# EAGLE design lab5 (EAGLE 7.2.0)
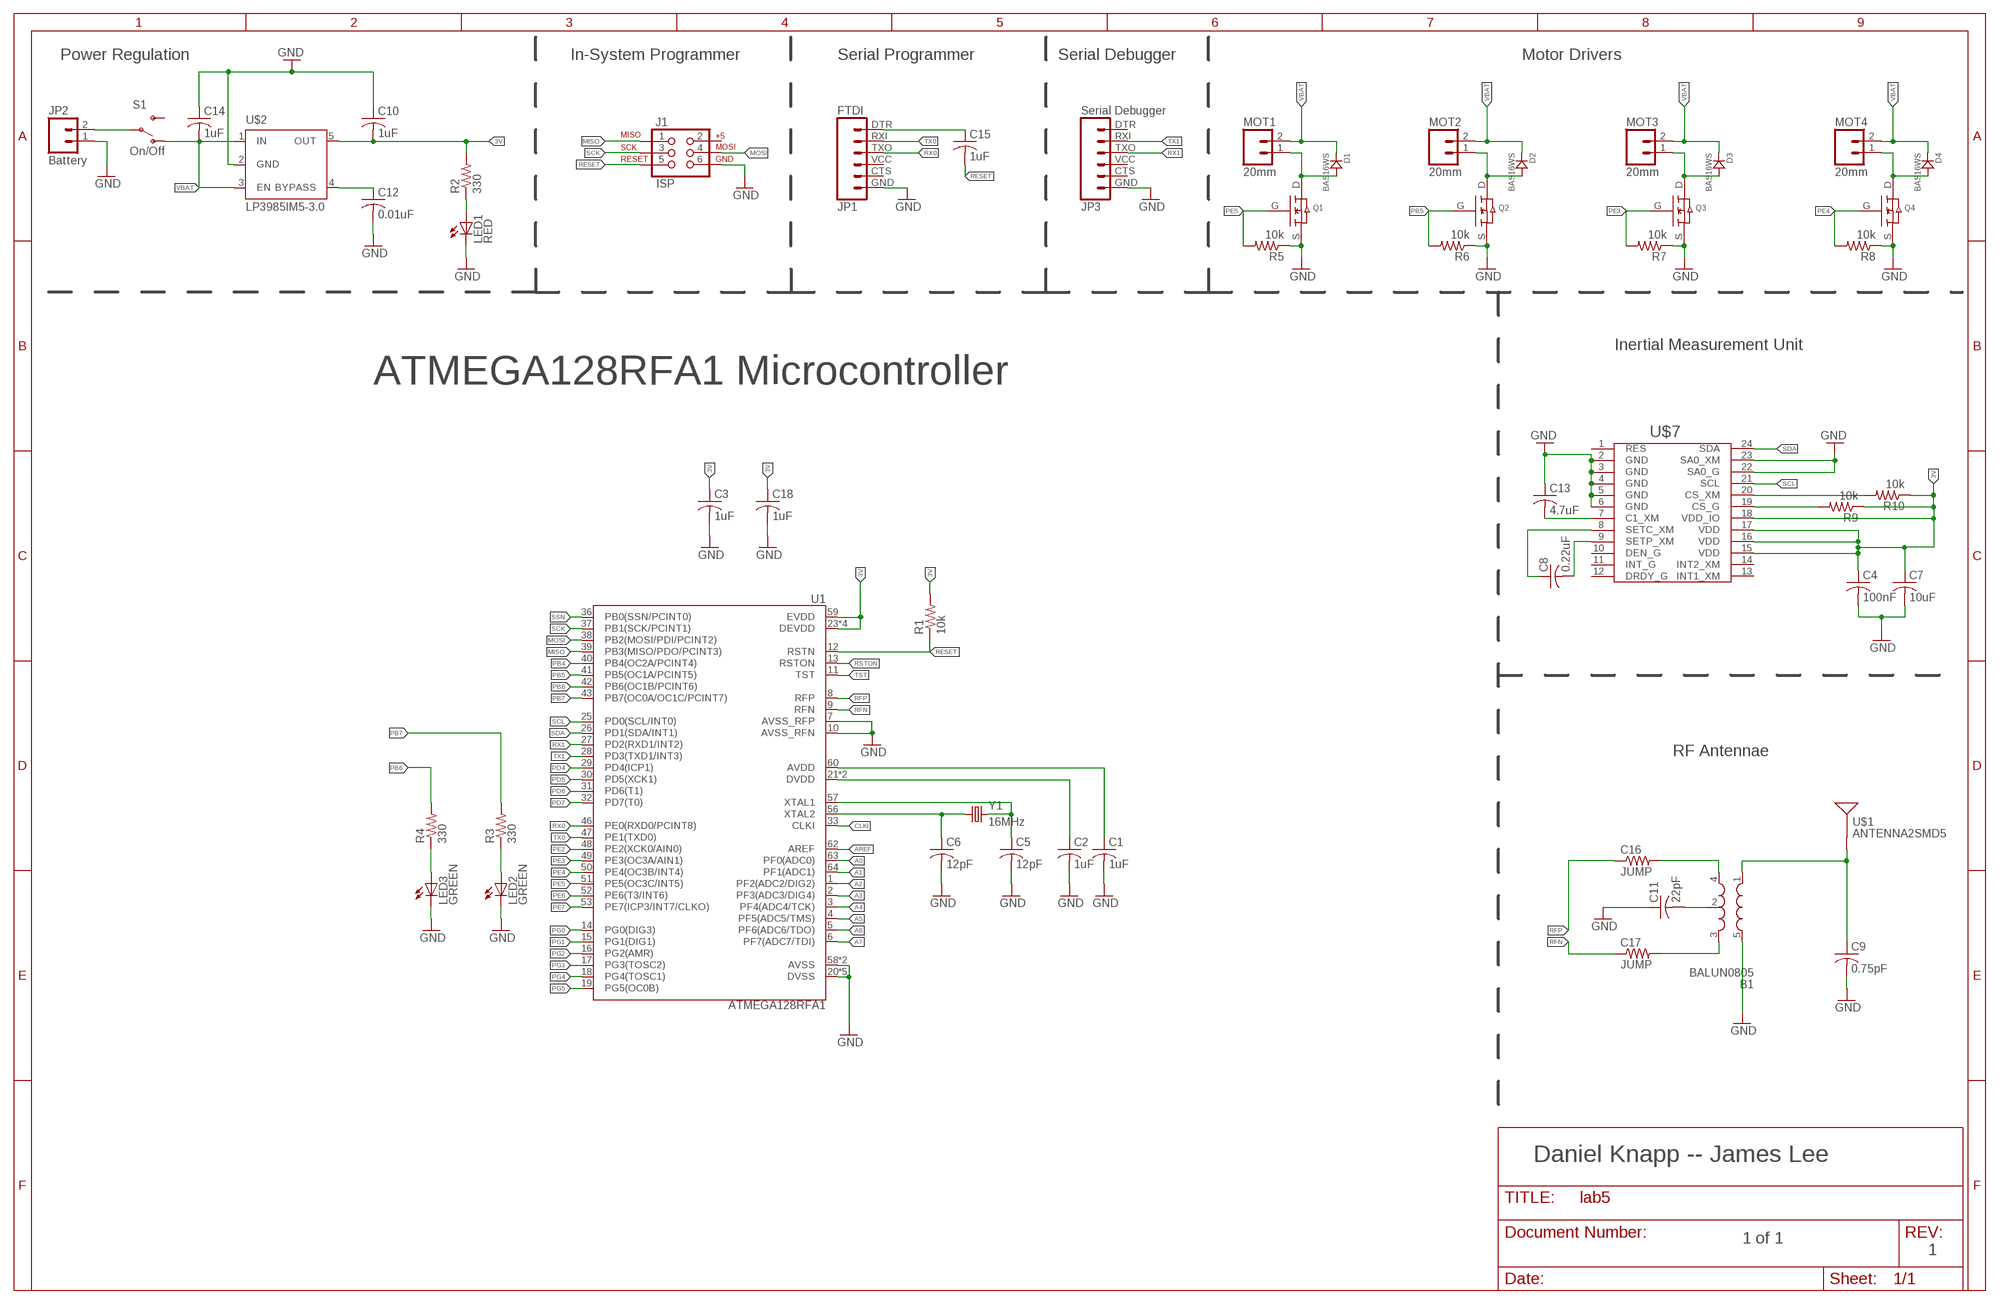
[diagram p0: schematic, sheet 1]

## Parts
B1  BALUN0805  [BALUN]
C1  1uF  C-USC0805  [C0805]
C2  1uF  C-USC0805  [C0805]
C3  1uF  C-USC0805  [C0805]
C4  100nF  C-USC0805  [C0805]
C5  12pF  C-USC0805  [C0805]
C6  12pF  C-USC0805  [C0805]
C7  10uF  C-USC0805  [C0805]
C8  0.22uF  C-USC0805  [C0805]
C9  0.75pF  C-USC0805  [C0805]
C10  1uF  C-USC0805  [C0805]
C11  22pF  C-USC0805  [C0805]
C12  0.01uF  C-USC0805  [C0805]
C13  4.7uF  C-USC0805  [C0805]
C14  1uF  C-USC0805  [C0805]
C15  1uF  C-USC0805  [C0805]
C16  JUMP  R-US_R0805  [R0805]
C17  JUMP  R-US_R0805  [R0805]
C18  1uF  C-USC0805  [C0805]
D1  BAS16WS  [BAS16WS]
D2  BAS16WS  [BAS16WS]
D3  BAS16WS  [BAS16WS]
D4  BAS16WS  [BAS16WS]
J1  ISP  AVR_SPI_PRG_6NS  [2X3-NS]
JP1  FTDI  FTDI_BASICPTH  [FTDI_BASIC]
JP2  Battery  M02PTH  [1X02]
JP3  Serial Debugger  FTDI_BASICPTH  [FTDI_BASIC]
LED1  RED  LEDCHIP-LED0805  [CHIP-LED0805]
LED2  GREEN  LEDCHIP-LED0805  [CHIP-LED0805]
LED3  GREEN  LEDCHIP-LED0805  [CHIP-LED0805]
MOT1  20mm  M02PTH  [1X02]
MOT2  20mm  M02PTH  [1X02]
MOT3  20mm  M02PTH  [1X02]
MOT4  20mm  M02PTH  [1X02]
Q1  SI2302CDS  [SI2302CDS]
Q2  SI2302CDS  [SI2302CDS]
Q3  SI2302CDS  [SI2302CDS]
Q4  SI2302CDS  [SI2302CDS]
R1  10k  R-US_R0805  [R0805]
R2  330  R-US_R0805  [R0805]
R3  330  R-US_R0805  [R0805]
R4  330  R-US_R0805  [R0805]
R5  10k  R-US_R0805  [R0805]
R6  10k  R-US_R0805  [R0805]
R7  10k  R-US_R0805  [R0805]
R8  10k  R-US_R0805  [R0805]
R9  10k  R-US_R0805  [R0805]
R10  10k  R-US_R0805  [R0805]
S1  On/Off  SWITCH-SPDTPTH  [SWITCH-SPDT]
U1  ATMEGA128RFA1  [QFN-64]
U$1  ANTENNA2SMD5  [ANTENNA-CHIP5]
U$2  LP3985IM5-3.0  [SOT23-DBV]
U$7  LSM9DS0  [LSM9DS0]
Y1  16MHz  CRYSTAL5X3  [CRYSTAL-SMD-5X3]

## Nets
3V: C3.1 C4.1 C7.1 C10.2 C18.1 R1.2 R2.2 R9.1 R10.1 U1.23(DEVDD) U1.34(DEVDD) U1.44(DEVDD) U1.54(DEVDD) U1.59(EVDD) U$2.5(OUT) U$7.15(VDD) U$7.16(VDD) U$7.17(VDD) U$7.18(VDD_IO)
A0: U1.63(PF0(ADC0))
A1: U1.64(PF1(ADC1))
A2: U1.1(PF2(ADC2/DIG2))
A3: U1.2(PF3(ADC3/DIG4))
A4: U1.3(PF4(ADC4/TCK))
A5: U1.4(PF5(ADC5/TMS))
A6: U1.5(PF6(ADC6/TDO))
A7: U1.6(PF7(ADC7/TDI))
AREF: U1.62(AREF)
CLKI: U1.33(CLKI)
GND: B1.5(GND) C1.2 C2.2 C3.2 C4.2 C5.2 C6.2 C7.2 C9.2 C10.1 C11.1 C12.2 C13.1 C14.1 C18.2 J1.6 JP1.GND JP2.1 JP3.GND LED1.C LED2.C LED3.C Q1.S Q2.S Q3.S Q4.S R5.1 R6.1 R7.1 R8.1 U1.7(AVSS_RFP) U1.10(AVSS_RFN) U1.20(DVSS) U1.24(DVSS) U1.35(DVSS) U1.45(DVSS) U1.55(DVSS) U1.58(AVSS) U1.61(AVSS) U$2.2(GND) U$7.2(GND) U$7.3(GND) U$7.4(GND) U$7.5(GND) U$7.6(GND) U$7.22(SA0_G) U$7.23(SA0_XM)
MISO: J1.1 U1.39(PB3(MISO/PDO/PCINT3))
MOSI: J1.4 U1.38(PB2(MOSI/PDI/PCINT2))
N$2: C12.1 U$2.4(BYPASS)
N$3: C15.1 JP1.DTR
N$4: LED1.A R2.1
N$5: C5.1 U1.57(XTAL1) Y1.3
N$6: JP2.2 S1.2(P)
N$7: C6.1 U1.56(XTAL2) Y1.1
N$8: C2.1 U1.21(DVDD) U1.22(DVDD)
N$9: C1.1 U1.60(AVDD)
N$10: B1.3(OUT2) C17.2
N$11: B1.2(GND) C11.2
N$12: B1.4(OUT1) C16.2
N$15: B1.1(IN) C9.1 U$1.FEED(SIGNAL)
N$16: LED3.A R4.1
N$17: LED2.A R3.1
N$18: D1.P$2 MOT1.1 Q1.D
N$20: D2.P$2 MOT2.1 Q2.D
N$22: D3.P$2 MOT3.1 Q3.D
N$24: D4.P$2 MOT4.1 Q4.D
N$25: C8.1 U$7.8(SETC_XM)
N$26: C8.2 U$7.9(SETP_XM)
N$27: C13.2 U$7.7(C1_XM)
N$29: R9.2 U$7.19(CS_G)
N$30: R10.2 U$7.20(CS_XM)
PB4: U1.40(PB4(OC2A/PCINT4))
PB5: Q2.G R6.2 U1.41(PB5(OC1A/PCINT5))
PB6: R4.2 U1.42(PB6(OC1B/PCINT6))
PB7: R3.2 U1.43(PB7(OC0A/OC1C/PCINT7))
PD4: U1.29(PD4(ICP1))
PD5: U1.30(PD5(XCK1))
PD6: U1.31(PD6(T1))
PD7: U1.32(PD7(T0))
PE2: U1.48(PE2(XCK0/AIN0))
PE3: Q3.G R7.2 U1.49(PE3(OC3A/AIN1))
PE4: Q4.G R8.2 U1.50(PE4(OC3B/INT4))
PE5: Q1.G R5.2 U1.51(PE5(OC3C/INT5))
PE6: U1.52(PE6(T3/INT6))
PE7: U1.53(PE7(ICP3/INT7/CLKO))
PG0: U1.14(PG0(DIG3))
PG1: U1.15(PG1(DIG1))
PG2: U1.16(PG2(AMR))
PG3: U1.17(PG3(TOSC2))
PG4: U1.18(PG4(TOSC1))
PG5: U1.19(PG5(OC0B))
RESET: C15.2 J1.5 R1.1 U1.12(RSTN)
RFN: C17.1 U1.9(RFN)
RFP: C16.1 U1.8(RFP)
RSTON: U1.13(RSTON)
RX0: JP1.TXO U1.46(PE0(RXD0/PCINT8))
RX1: JP3.TXO U1.27(PD2(RXD1/INT2))
SCK: J1.3 U1.37(PB1(SCK/PCINT1))
SCL: U1.25(PD0(SCL/INT0)) U$7.21(SCL)
SDA: U1.26(PD1(SDA/INT1)) U$7.24(SDA)
SSN: U1.36(PB0(SSN/PCINT0))
TST: U1.11(TST)
TX0: JP1.RXI U1.47(PE1(TXD0))
TX1: JP3.RXI U1.28(PD3(TXD1/INT3))
VBAT: C14.2 D1.P$1 D2.P$1 D3.P$1 D4.P$1 MOT1.2 MOT2.2 MOT3.2 MOT4.2 S1.1(O) U$2.1(IN) U$2.3(EN)
Unconnected: J1.2 JP1.CTS JP1.VCC JP3.CTS JP3.DTR JP3.VCC S1.3(S) U$7.1(RES) U$7.10(DEN_G) U$7.11(INT_G) U$7.12(DRDY_G) U$7.13(INT1_XM) U$7.14(INT2_XM)

## Notes on the sheet
- Power Regulation | In-System Programmer | Serial Programmer | Serial Debugger | Motor Drivers
- Inertial Measurement Unit
- ATMEGA128RFA1 Microcontroller
- RF Antennae
- Daniel Knapp -- James Lee
- 1 of 1
- 1

## Library data of the parts
B1 = lab5_comps:BALUN: 0805 footprint balun- Ember 351/357
C1-C15 C18 = lab5_comps:C-US: CAPACITOR, American symbol
C16 C17 R1-R10 = lab5_comps:R-US_: RESISTOR, American symbol
D1-D4 = lab5_comps:BAS16WS; CREATOR: Daniel Knapp; DIST: Digikey
J1 = lab5_comps:AVR_SPI_PRG_6: AVR ISP 6 Pin This is the reduced ISP connector for AVR programming. Common on Arduino. This footprint will take up less PCB space and can be used with a 10-pin to 6-pin adapter such as SKU: BOB-08508
JP1 JP3 = lab5_comps:FTDI_BASIC: FTDI Basic header with labels
JP2 MOT1-MOT4 = lab5_comps:M02: Header 2 Standard 2-pin 0.1" header. Use with straight break away headers (SKU : PRT-00116), right angle break away headers (PRT-00553), swiss pins (PRT-00743), machine pins (PRT-00117), and female headers (PRT-00115). Molex polarized connector foot print use with SKU : PRT-08233 with associated crimp pins and housings.
LED1-LED3 = lab5_comps:LED: LED OSRAM: - CHIPLED LG R971, LG N971, LY N971, LG Q971, LY Q971, LO R971, LY R971 LH N974, LH R974 LS Q976, LO Q976, LY Q976 LO Q996 - Hyper CHIPLED LW Q18S LB Q993, LB Q99A, LB R99A - SideLED LS A670, LO A670, LY A670, LG A670, LP A670 LB A673, LV A673, LT A673, LW A673 LH A674 LY A675 LS A676, LA A676, LO A676, LY A676, LW A676 LS A679, LY A679, LG A679 - Hyper Micro SIDELED® LS Y876, LA Y876, LO Y876, LY Y876 LT Y87S - SmartLED LW L88C, LW L88S LB L89C, LB L89S, LG L890 LS L89K, LO L89K, LY L89K LS L896, LA L896, LO L896, LY L896 - TOPLED LS T670, LO T670, LY T670, LG T670, LP T670 LSG T670, LSP T670, LSY T670, LOP T670, LYG T670 LG T671, LOG T671, LSG T671 LB T673, LV T673, LT T673, LW T673 LH T674 LS T676, LA T676, LO T676, LY T676, LB T676, LH T676, LSB T676, LW T676 LB T67C, LV T67C, LT T67C, LS T67K, LO T67K, LY T67K, LW E67C LS E67B, LA E67B, LO E67B, LY E67B, LB E67C, LV E67C, LT E67C LW T67C LS T679, LY T679, LG T679 LS T770, LO T770, LY T770, LG T770, LP T770 LB T773, LV T773, LT T773, LW T773 LH T774 LS E675, LA E675, LY E675, LS T675 LS T776, LA T776, LO T776, LY T776, LB T776 LHGB T686 LT T68C, LB T68C - Hyper Mini TOPLED® LB M676 - Mini TOPLED Santana® LG M470 LS M47K, LO M47K, LY M47K Source: http://www.osram.convergy.de LUXEON: - LUMILED® LXK2-PW12-R00, LXK2-PW12-S00, LXK2-PW14-U00, LXK2-PW14-V00 LXK2-PM12-R00, LXK2-PM12-S00, LXK2-PM14-U00 LXK2-PE12-Q00, LXK2-PE12-R00, LXK2-PE12-S00, LXK2-PE14-T00, LXK2-PE14-U00 LXK2-PB12-K00, LXK2-PB12-L00, LXK2-PB12-M00, LXK2-PB14-N00, LXK2-PB14-P00, LXK2-PB14-Q00 LXK2-PR12-L00, LXK2-PR12-M00, LXK2-PR14-Q00, LXK2-PR14-R00 LXK2-PD12-Q00, LXK2-PD12-R00, LXK2-PD12-S00 LXK2-PH12-R00, LXK2-PH12-S00 LXK2-PL12-P00, LXK2-PL12-Q00, LXK2-PL12-R00 Source: www.luxeon.com KINGBRIGHT: KA-3528ASYC Source: www.kingbright.com
Q1-Q4 = lab5_comps:SI2302CDS; CREATOR: Daniel Knapp; DIST: Digikey
S1 = lab5_comps:SWITCH-SPDT: SPDT Switch Simple slide switch, Spark Fun Electronics SKU : COM-00102 DPDT SMT slide switch, AYZ0202, SWCH-08179; PROD_ID: SWCH-08261
U1 = lab5_comps:ATMEGA128RFA1: ATmega128RFA1 8-bit AVR Microcontroller with Low Power 2.4GHz Transceiver for ZigBee and IEEE 802.15.4
U$1 = lab5_comps:ANTENNA2: Chip antenna Single endded antenna. Common with smaller chip antennas. CHIP4 package is the GPS Chip Antenna SKU: GPS-08418. CHIP5 package is 2.4GHz chip antenna SKU: WRL-00144.
U$2 = lab5_comps:LP3985IM5-3.0
U$7 = lab5_comps:LSM9DS0; CREATOR: Daniel Knapp; DIST: Digikey
Y1 = lab5_comps:CRYSTAL: Various standard crystals. Proven footprints. Spark Fun Electronics SKU : COM-00534

## Board
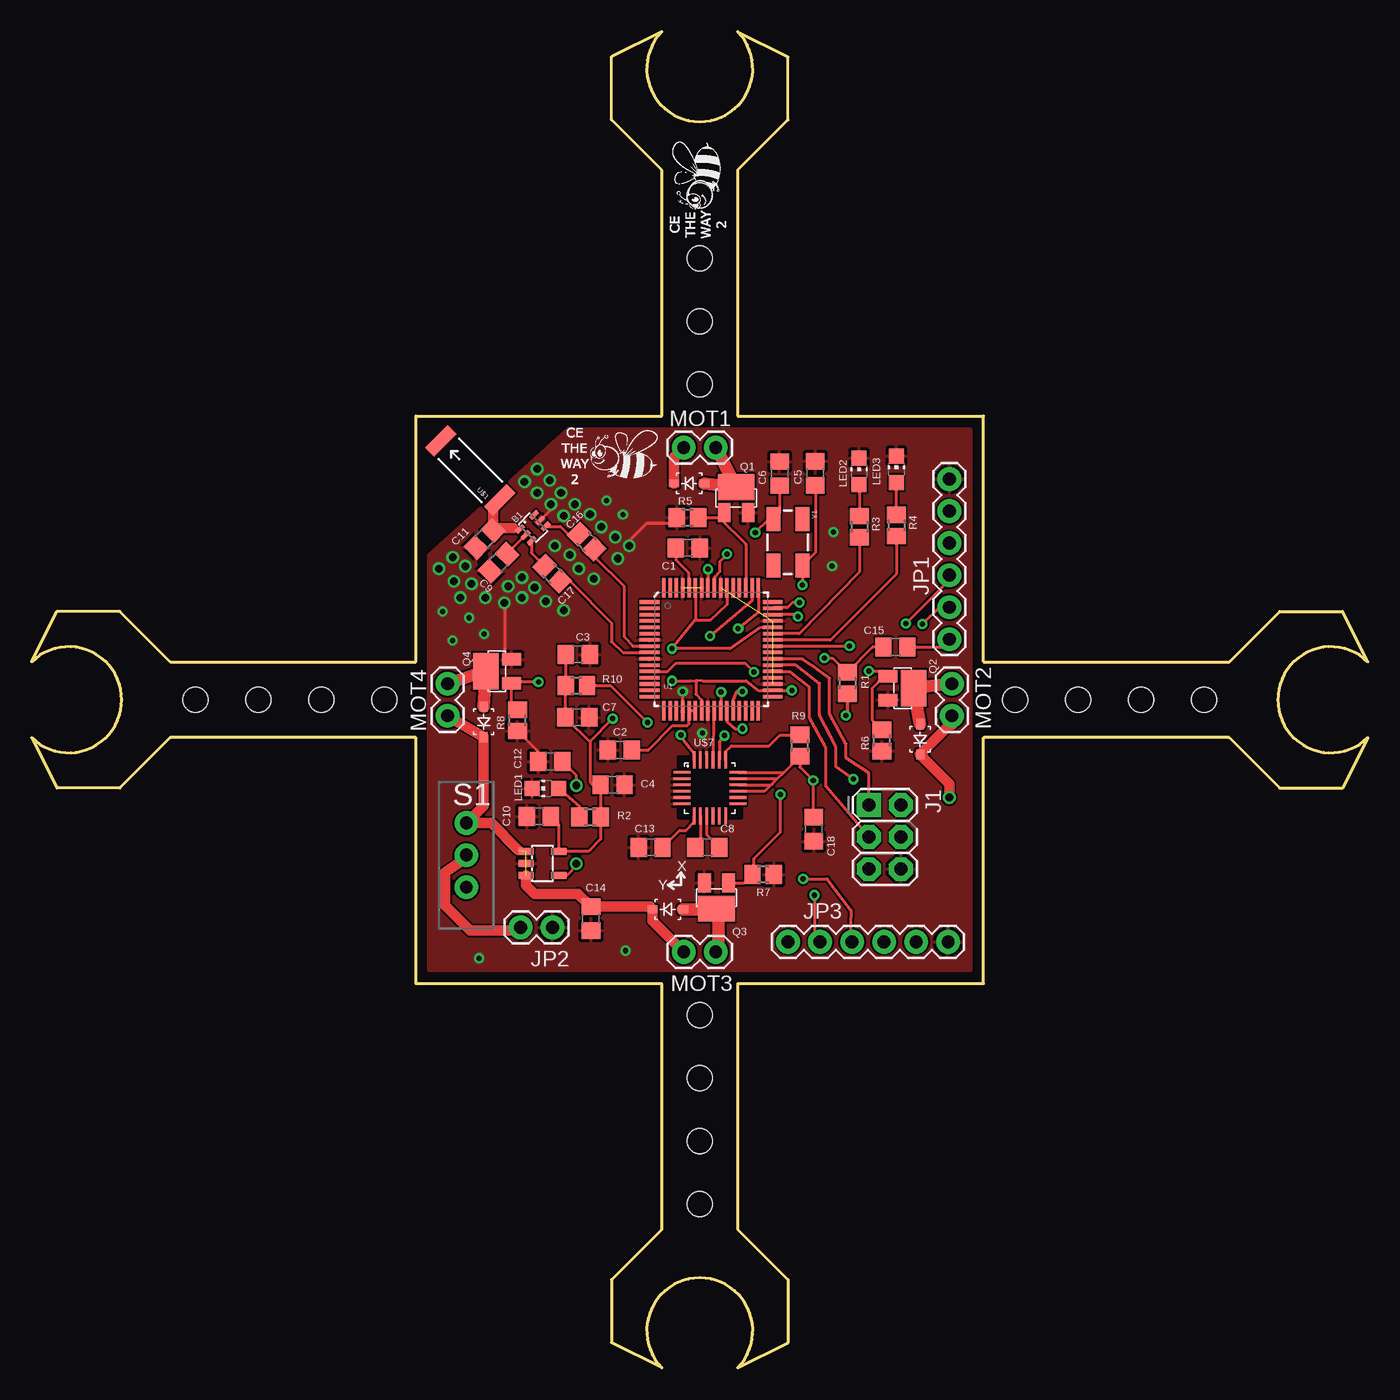
[diagram p1: board, top side]
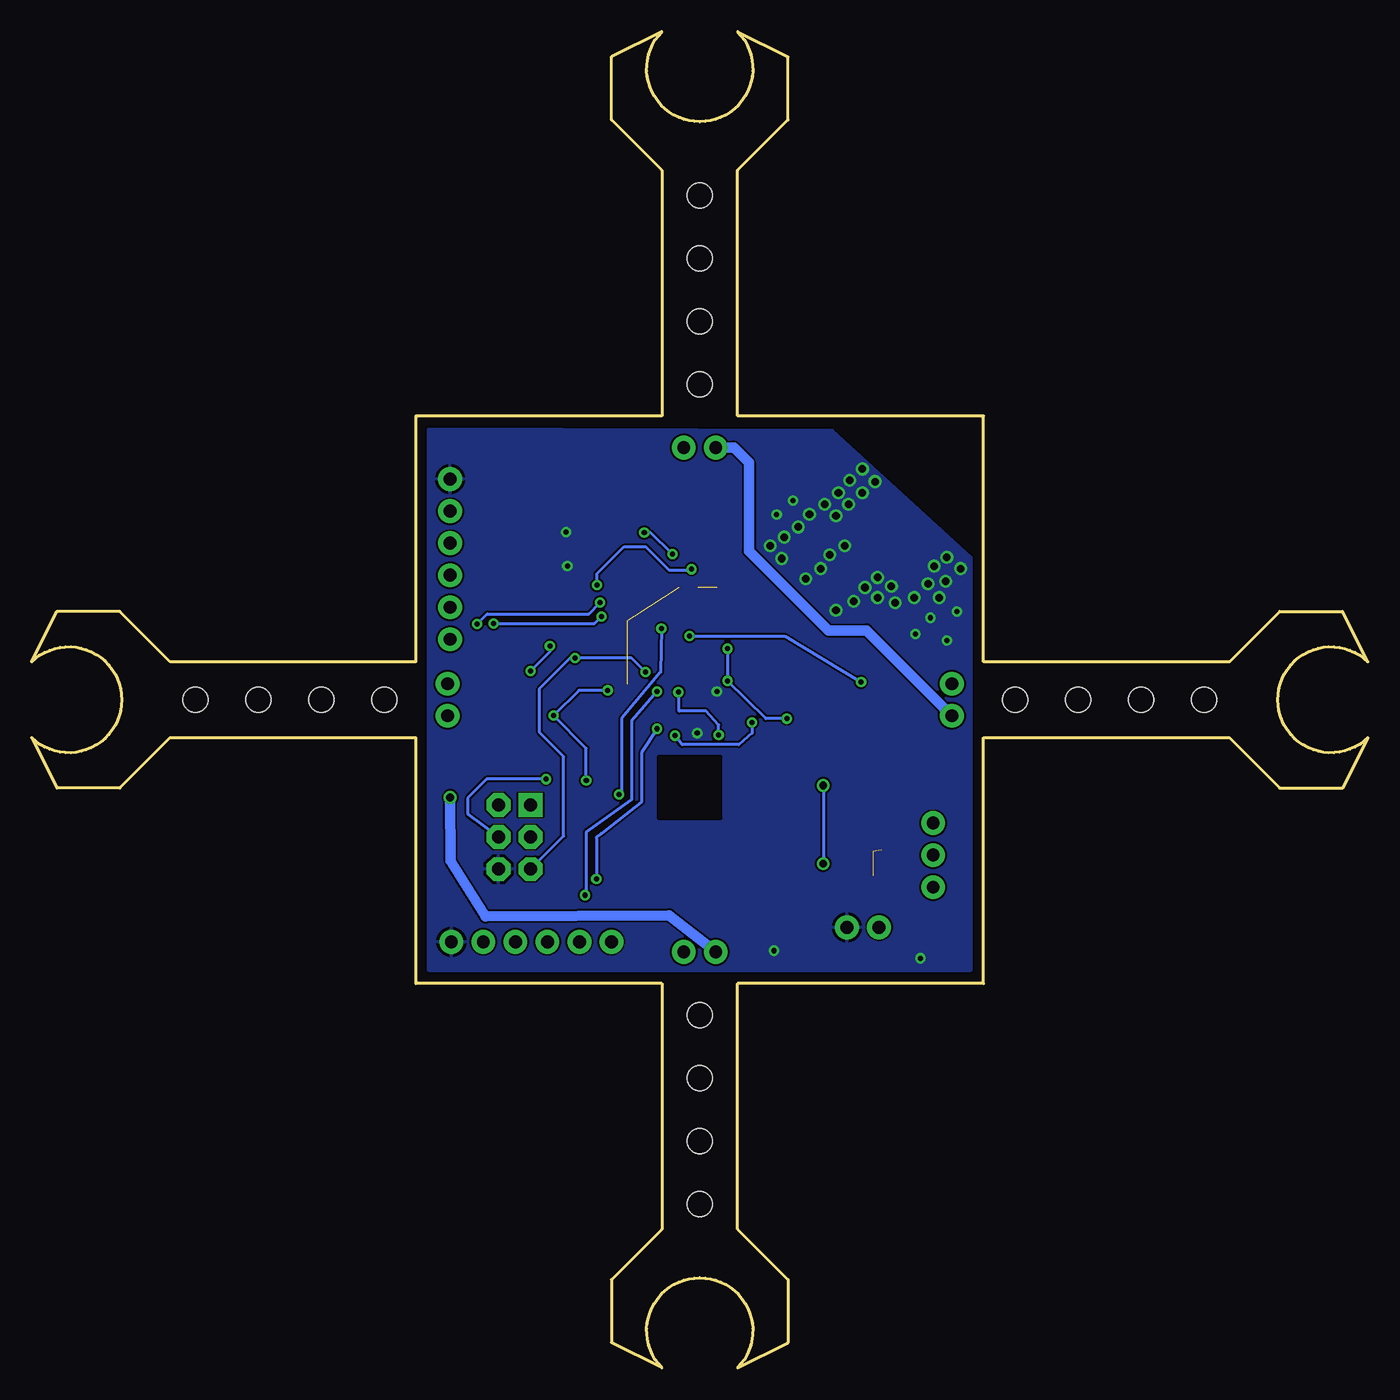
[diagram p2: board, bottom side, seen from below]

Size 106 x 106 mm. Coordinates in mm from the lower left corner, seen from the top.
Outline: 50,75.5 50,95 46,99 46,104 50,106 arc269 56,106 60,104 60,99 56,95 56,75.5 75.5,75.5 75.5,56 95,56 99,60 104,60 106,56 arc269 106,50 104,46 99,46 95,50 75.5,50 75.5,30.5 56,30.5 56,11 60,7 60,2 56,0 arc269 50,0 46,2 46,7 50,11 50,30.5 30.5,30.5 30.5,50 11,50 7,46 2,46 0,50 arc269 0,56 2,60 7,60 11,56 30.5,56 30.5,75.5 50,75.5
Copper layers (1*16): Top 0.035559375mm / dielectric 1.501140625mm / Bottom 0.035559375mm
Design rules "4pcb-33board": minimum track width 6mil, minimum drill 15mil, track to track 6mil, track to pad 6mil, pad to pad 6mil, via to via 6mil, smd to smd 6mil, copper to edge 10mil, drill to drill 10mil, minimum pad ring 10mil, minimum via ring 8mil, stop-mask expansion 4mil, vias tented up to drill 0mil, thermal gap 10mil
Holes 2 mm at 13,53 18,53 23,53 28,53 78,53 83,53 88,53 93,53 53,28 53,23 53,18 53,13 53,78 53,83 53,88 53,93
tRestrict: area 31,64.5 to 42.5,75; area 51.5,43.8 to 56.2,48.3
bRestrict: area 31,64.5 to 42.5,75; area 51.5,43.8 to 56.2,48.3

### Footprints (pad centres in the part's own frame; a part is rotated, then mirrored left to right if it is on the bottom)
BALUN = smd 0.35 x 0.8: 1 -0.65,-0.8; 2 0,-0.8; 3 0.65,-0.8; 4 0.65,0.8; 5 0,0.8; 6 -0.65,0.8
C0805 = smd 1.3 x 1.5: 1 -0.95,0; 2 0.95,0
R0805 = smd 1.3 x 1.5: 1 -0.85,0; 2 0.85,0
BAS16WS = smd 0.8 x 0.6: P$1 -1.2,0; P$2 1.2,0
2X3-NS = drill 1.016 pad 1.88 square: 1 -2.54,-1.27 | drill 1.016 pad 1.88 octagon: 2 -2.54,1.27; 3 0,-1.27; 4 0,1.27; 5 2.54,-1.27; 6 2.54,1.27
FTDI_BASIC = drill 1.016 pad 1.88: CTS 10.16,0; DTR 0,0; GND 12.7,0; RXI 2.54,0; TXO 5.08,0; VCC 7.62,0
1X02 = drill 1.016 pad 1.88: 1 -1.27,0; 2 1.27,0
CHIP-LED0805 = smd 1.2 x 1.2: A 0,-1.05; C 0,1.05
SI2302CDS = smd 2.9 x 2.05: D 0,0.875 | smd 1 x 1.5: G -0.95,-1.15; S 0.95,-1.15
SWITCH-SPDT = drill 1.016 pad 1.88: 1 0,2.54; 2 0,0; 3 0,-2.54
QFN-64 = smd 1.562 x 0.28: 1 -4.881,3.75; 2 -4.881,3.25; 3 -4.881,2.75; 4 -4.881,2.25; 5 -4.881,1.75; 6 -4.881,1.25; 7 -4.881,0.75; 8 -4.881,0.25; 9 -4.881,-0.25; 10 -4.881,-0.75; 11 -4.881,-1.25; 12 -4.881,-1.75; 13 -4.881,-2.25; 14 -4.881,-2.75; 15 -4.881,-3.25; 16 -4.881,-3.75; 33 4.881,-3.75; 34 4.881,-3.25; 35 4.881,-2.75; 36 4.881,-2.25; 37 4.881,-1.75; 38 4.881,-1.25; 39 4.881,-0.75; 40 4.881,-0.25; 41 4.881,0.25; 42 4.881,0.75; 43 4.881,1.25; 44 4.881,1.75; 45 4.881,2.25; 46 4.881,2.75; 47 4.881,3.25; 48 4.881,3.75 | smd 0.28 x 1.562: 17 -3.75,-4.881; 18 -3.25,-4.881; 19 -2.75,-4.881; 20 -2.25,-4.881; 21 -1.75,-4.881; 22 -1.25,-4.881; 23 -0.75,-4.881; 24 -0.25,-4.881; 25 0.25,-4.881; 26 0.75,-4.881; 27 1.25,-4.881; 28 1.75,-4.881; 29 2.25,-4.881; 30 2.75,-4.881; 31 3.25,-4.881; 32 3.75,-4.881; 49 3.75,4.881; 50 3.25,4.881; 51 2.75,4.881; 52 2.25,4.881; 53 1.75,4.881; 54 1.25,4.881; 55 0.75,4.881; 56 0.25,4.881; 57 -0.25,4.881; 58 -0.75,4.881; 59 -1.25,4.881; 60 -1.75,4.881; 61 -2.25,4.881; 62 -2.75,4.881; 63 -3.25,4.881; 64 -3.75,4.881
ANTENNA-CHIP5 = smd 1.016 x 2.54: FEED -3.302,0; NC 3.302,0
SOT23-DBV = smd 0.55 x 1.2: 1 -0.95,-1.3; 2 0,-1.3; 3 0.95,-1.3; 4 0.95,1.3; 5 -0.95,1.3
LSM9DS0 = smd 1.35 x 0.2: 1 -2.225,1.25; 2 -2.225,0.75; 3 -2.225,0.25; 4 -2.225,-0.25; 5 -2.225,-0.75; 6 -2.225,-1.25; 13 2.225,-1.25; 14 2.225,-0.75; 15 2.225,-0.25; 16 2.225,0.25; 17 2.225,0.75; 18 2.225,1.25 | smd 0.2 x 1.35: 7 -1.25,-2.225; 8 -0.75,-2.225; 9 -0.25,-2.225; 10 0.25,-2.225; 11 0.75,-2.225; 12 1.25,-2.225; 19 1.25,2.225; 20 0.75,2.225; 21 0.25,2.225; 22 -0.25,2.225; 23 -0.75,2.225; 24 -1.25,2.225
CRYSTAL-SMD-5X3 = smd 1.9 x 1.1: 1 -1.85,-1.15; 2 1.85,-1.15; 3 1.85,1.15; 4 -1.85,1.15

### Placement (x,y rotation side)
B1  39.76,66.64 315 top
C1  52.06,65.04 0 top
C2  46.66,49.02 180 top
C3  43.34,56.6 0 top
C4  46.08,46.26 0 top
C5  62.16,70.96 90 top
C6  59.34,70.94 90 top
C7  43.28,51.61 0 top
C8  53.6,41.3 0 top
C9  35.93,65.76 225 top
C10  40.24,43.75 0 top
C11  37.04,63.87 45 top
C12  41.16,48.11 180 top
C13  49.1,41.3 0 top
C14  44.37,35.64 90 top
C15  68.52,57.18 180 top
C16  44.03,65.54 135 top
C17  41.3,63 135 top
C18  62.04,42.72 270 top
D1  52.16,70.16 0 top
D2  70.48,49.86 90 top
D3  50.46,36.38 0 top
D4  35.86,51.26 90 top
J1  67.69,42.11 270 top
JP1  72.8,57.8 90 top
JP2  40.05,34.95 180 top
JP3  60,33.8 0 top
LED1  40.75,45.97 90 top
LED2  65.64,71.13 0 top
LED3  68.59,71.28 0 top
MOT1  53,73 180 top
MOT2  73,53 270 top
MOT3  53,33 180 top
MOT4  33,53 270 top
Q1  55.89,68.99 0 top
Q2  69.09,53.92 270 top
Q3  54.33,37.31 180 top
Q4  36.91,55.26 90 top
R1  64.7,54.32 270 top
R2  44.3,43.7 0 top
R3  65.66,66.72 270 top
R4  68.59,66.83 270 top
R5  52.03,67.44 0 top
R6  67.44,49.77 90 top
R7  58.03,39.14 180 top
R8  38.54,51.37 90 top
R9  60.94,49.38 90 top
R10  43.21,54.12 0 top
S1  34.49,40.68 0 top
U1  53.9,57 0 top
U$1  34.8,71.2 135 top
U$2  40.52,40.02 270 top
U$3  [BEE_LOGO]  45.9,72.2 0 top
U$4  [BEE_LOGO]  53,93.5 90 top
U$7  53.8,46 0 top
Y1  59.99,65.49 270 top

### Tracks (layer width: path | path; a pad name or v marks a point on that pad's centre or on a via)
3V  (via drill 0.4)
  Top 0.254: C3.1 42.39,54.15 R10.1 42.36,51.64 C7.1 44.3,49.64 | C10.2 41.82,43.12 U$2.5 44.17,40.97 45.15,41.95 R2.2 45.15,46.04 45.35,46.04 C4.1 44.54,46.26 44.3,46.5 44.3,49.64 | 44.3,49.64 44.3,49.7 v46.1,51.5 | U1.44 57.7,58.7 55.4,57.05 v50.8,57.05 52.65,59.35 | 52.6,61.83 U1.59 52.65,59.35 | 52.7,54.51 52.7,53.45 53.15,53 53.15,52.7 53.2,52.65 53.15,52.6 U1.23 | v50.8,54.5 52.25,54.5 52.7,54.51 | 52.7,54.51 53.2,54.5 56.7,54.5 57.7,53.7 58.73,53.7 U1.34 v60.3,53.75 | U1.54 55.15,60.55 53.8,59.3 52.65,59.3 52.65,59.35 | 64.42,53.75 R1.2 | R1.2 64.7,51.9 v64.59,51.74 64.7,51.85 R1.2 | C18.1 62,43.71 v62,46.6 60.94,47.66 R9.1 59.66,47.25 | U$7.18 59.66,47.25 | U$7.15 58.16,45.75 58.66,46.25 | 59.16,46.75 58.73,46.32 58.66,46.25 | 59.16,46.75 59.66,47.25 | U$7.17 59.16,46.75 | U$7.16 58.66,46.25
  Bottom 0.254: v50.8,57.05 v50.8,54.5 47.75,51.5 v46.1,51.5 | v60.3,53.75 62.58,53.75 v64.59,51.74 62,49.15 v62,46.6
GND  (via drill 0.4, 0.6)  (3 unrouted)
  Top 0.254: B1.5 41.2,68.08 v41.2,68.5 | R8.1 40.21,48.85 C12.2 39.7,47.6 | C10.1 | 39.7,45.37 LED1.C | v37.5,60.7 37.5,56.77 Q4.S | v47.4,65.2 47.4,65.6 48.8,67 50.74,67 R5.1 | v51.65,53.65 51.6,52.17 U1.20 | 53.32,38.4 Q3.S
  other vias: 40.1,71.3 39.1,70.3 40.1,69.4 41.1,70.4 38.9,62.7 34.9,62.2 39.9,61.9 41.5,65.2 42.7,64.5 43.4,63.4 40.8,60.8 44.6,62.6 46.5,64.2 37.8,62 38.9,61.1 34,61.1 33.5,62.4 36,61.1 34.4,63.6 33.4,64.3 32.3,63.4 42.2,67.6 46.3,65.9 45.2,66.7 44.3,67.7 43.1,68.5 42,69.4 42.2,60.1 32.6,60 33.4,57.7 35.9,58.2 34.7,59.5 46.9,67.7 45.6,68.8 63.5,63.6 63.6,66.3 47.1,33.1 35.5,32.5 53.2,50.35
  pour Bottom: 31.5,31.5 74.5,31.5 74.5,74.5 42.5,74.4 31.5,64.3
  pour Top: 31.5,64.5 42.5,74.5 74.5,74.5 74.5,31.5 31.5,31.5
MISO
  Top 0.254: J1.1 66.4,44.67 66.4,47.2 64.6,48.4 64.6,49.5 63.3,51.9 63.3,54.7 61.9,55.7 61.15,56.25 U1.39
MOSI  (via drill 0.4)
  Top 0.254: v65.2,46.7 63.8,47.7 63.8,49.3 62.5,51.8 62.5,54.3 60.65,55.75 U1.38
  Bottom 0.254: v65.2,46.7 69.9,46.7 71.4,45.2 71.4,43.95 J1.4
N$2  (via drill 0.6)
  Top 0.254: C12.1 43.2,47.02 v43.2,46.2 | v43.2,40 43.2,39.8 42.5,39.1 41.85,39.1 U$2.4
  Bottom 0.254: v43.2,46.2 v43.2,40
N$3
  Top 0.254: C15.1 72.18,57.18 JP1.DTR
N$4
  Top 0.254: LED1.A 43.45,44.52 R2.1
N$5  (via drill 0.4)
  Top 0.254: C5.1 62.16,64.66 Y1.3 v61.14,62.11 v61.15,62.1 | v53.65,63.35 U1.57
  Bottom 0.254: v61.15,62.1 61.15,63 59,65.15 57.3,65.15 55.45,63.3 53.7,63.3 v53.65,63.35
N$6
  Top 0.813: S1.2 34.49,40.49 32.8,39.3 32.8,36.7 34.8,34.7 38.53,34.7 JP2.2
N$7  (via drill 0.4)
  Top 0.254: C6.1 59.34,67.84 Y1.1 | Y1.1 58.44,67.34 | U1.56 54.2,61.93 54.2,62.75 54.6,63.15 54.6,63.95 v55.15,64.55 | v57.4,66.25 58.49,67.34 Y1.1
  Bottom 0.254: v55.15,64.55 56.9,66.25 v57.4,66.25
N$8
  Top 0.254: C2.1 48.92,49.02 50.85,50.95 52,50.95 52.15,51.1 U1.21 U1.22
N$9
  Top 0.254: C1.1 51.11,64.09 52.1,63.1 52.1,61.93 U1.60
N$10
  Top 0.254: B1.3 39.65,64.65 C17.2
N$11
  Top 0.254: C11.2 38.61,65.49 B1.2
N$12
  Top 0.254: B1.4 41.95,66.75 42.8,65.9 43.19,65.9 C16.2
N$13
  cutout Top: 51.3,48.5 56.3,48.5 56.3,43.6 51.3,43.6
  cutout Bottom: 51.3,48.5 56.3,48.5 56.3,43.6 51.3,43.6
N$15
  Top 0.254: 38.2,66.6 38.27,66.53 B1.1
  Top 0.813: U$1.FEED 36.6,68.33 C9.1 36.77,66.6 38.2,66.6
N$16
  Top 0.254: R4.1 LED3.A
N$17
  Top 0.254: LED2.A 65.66,70.06 R3.1
N$18
  Top 1: MOT1.1 Q1.D D1.P$2
N$20
  Top 1: MOT2.1 Q2.D D2.P$2
N$22
  Top 0.813: 54.12,36.38 54.25,36.25 54.5,36 | 54.5,33.23 MOT3.1
  Top 1: D3.P$2 54.12,36.38 | 54.5,36 54.5,33.23 | Q3.D 54.33,36.33 54.25,36.25
N$24
  Top 1: MOT4.1 Q4.D D4.P$2
N$25
  Top 0.254: U$7.8 53.05,41.7 C8.1
N$26
  Top 0.254: U$7.9 53.55,42.3 C8.2
N$27
  Top 0.254: C13.2 51.4,42.65 51.9,42.65 52.55,43.3 U$7.7
N$29
  Top 0.254: U$7.19 55.05,48.9 55.5,49.35 58.5,49.35 59.35,50.2 60.91,50.2 R9.2
N$30  (via drill 0.4)
  Top 0.254: R10.2 45.93,54.12 v48.85,51.2 | v54.95,50.15 54.55,49.65 U$7.20
  Bottom 0.254: v48.85,51.2 48.85,50.35 49.9,49.45 54.4,49.45 v54.95,50.15
PB5  (via drill 0.4)
  Top 0.254: R6.2 66.7,51.36 66.7,53.95 67.62,54.87 Q2.G 67.52,55.29 v66.41,55.29 | U1.41 64.87,57.25 v64.89,57.27
  Bottom 0.254: v64.89,57.27 64.89,56.81 v66.41,55.29
PB6
  Top 0.254: R4.2 68.59,62.95 63.36,57.72 58.81,57.72 U1.42
PB7
  Top 0.254: R3.2 65.66,63.11 60.9,58.25 U1.43
PE3  (via drill 0.4)
  Top 0.254: Q3.G 56.5,38.46 R7.2 57.3,39.26 57.3,40.4 59.4,42.5 v59.4,45.5 | U1.49 57.65,59.96 v56.05,58.65
  Bottom 0.254: v56.05,58.65 56.1,55.2 59.2,51.5 59.2,45.7 v59.4,45.5
PE4  (via drill 0.4)
  Top 0.254: R8.2 38.06,52.7 Q4.G 38.15,54.4 v40.2,54.4 | U1.50 57.15,60.85 v53.8,58.05
  Bottom 0.254: v53.8,58.05 46.25,58.05 v40.2,54.4
PE5
  Top 0.254: R5.2 54.54,67.44 | 54.54,67.44 Q1.G | 54.54,67.44 56.65,65.33 U1.51
RESET  (via drill 0.4)
  Top 0.254: 57.25,55.25 v57.3,55.2 | v62.9,56.3 63.52,56.3 R1.1 66.71,57.18 C15.2 | 57.3,55.25 v57.3,55.2 | U1.12 50.45,55.25 51.1,55.9 56.6,55.9 v57.3,55.2
  Bottom 0.254: v57.3,55.2 58.4,56.3 v62.9,56.3 63.3,56.3 65.7,53.9 65.7,50.4 63.8,48.5 63.8,42.19 J1.5
RFN
  Top 0.254: C17.1 42.7,62.4 46,59.1 46,57.6 46.9,56.75 U1.9
RFP
  Top 0.254: C16.1 44.63,64.37 47,62 47,58 47.7,57.25 U1.8
RX0  (via drill 0.4)
  Top 0.254: v60.8,59.6 60.65,59.75 U1.46 | JP1.TXO 72.8,62.5 v69.35,59.05
  Bottom 0.254: v69.35,59.05 61.35,59.05 v60.8,59.6
RX1  (via drill 0.4)
  Top 0.254: U1.27 55.15,51.25 55.8,50.7 v56.4,50.7 | v61.2,38.8 63.1,38.8 65,36.3 64.9,33.98 JP3.TXO
  Bottom 0.254: v56.4,50.7 57.6,48.8 57.6,44.9 60.8,42.4 61.2,42.1 v61.2,38.8
SCK
  Top 0.254: J1.3 63,46.13 63,49.2 61.7,51.6 61.7,54 60.2,55.2 59.4,55.2 59.35,55.25 U1.37
SCL
  Top 0.254: U$7.21 54.15,52.02 U1.25
SDA  (via drill 0.4)
  Top 0.254: U$7.24 52.55,48.75 51.5,50 v51.5,50.2 | v54.7,53.6 54.7,52.17 U1.26
  Bottom 0.254: v51.5,50.2 51.5,51 52.5,52.1 54.63,52.1 U1.26 54.65,53.55 v54.7,53.6
TX0  (via drill 0.4)
  Top 0.254: JP1.RXI 72.04,60.34 v70.65,59 | v60.9,60.7 60.35,60.7 59.95,60.3 58.83,60.3 U1.47
  Bottom 0.254: v70.65,59 69.85,59.8 61.8,59.8 v60.9,60.7
TX1  (via drill 0.4)
  Top 0.254: v62.1,37.5 62.1,34.24 JP3.RXI | U1.28 55.65,52.91 55.95,53.66 v56.4,53.65
  Bottom 0.254: v56.4,53.65 57.4,52.5 58.4,51.3 58.4,45.1 62,42.5 62,37.6 v62.1,37.5
VBAT  (via drill 0.6)  (2 unrouted)
  Top 0.813: 38.6,41.1 36.48,43.22 S1.1 35.86,44.59 D4.P$1 MOT4.2 | U$2.3 39.22,38.28 39.9,37.6 43.36,37.6 C14.2 49.05,36.59 D3.P$1 49.26,35.47 MOT3.2 | D1.P$1 50.96,72.23 MOT1.2 | MOT2.2 73,51.1 | 73,51.1 73,50.98 | v72.8,45.25 72.8,46.34 D2.P$1 72.92,51.1 73,51.1
  Bottom 0.813: MOT3.2 55.43,35.9 70,35.8 72.75,40.2 v72.8,45.25 | MOT1.2 50.3,73 49.1,71.8 49.1,64.8 42.8,58.5 39.77,58.5 MOT4.2

### Text on the board
tPlace: X | Y